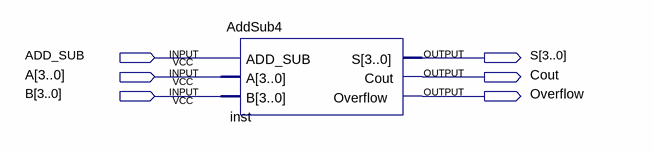
[diagram p0: schematic sheet]
// Quartus schematic AddSubDemo.bdf as structural Verilog: 1 symbols, 6 pins
module AddSubDemo (
  input  ADD_SUB,
  input  [3:0] A,
  input  [3:0] B,
  output [3:0] S,
  output Cout,
  output Overflow
);

  AddSub4 inst (.ADD_SUB(ADD_SUB), .A(A), .B(B), .S(S), .Cout(Cout), .Overflow(Overflow));
endmodule
